# Altium schematic sheet VL53L_SZ_Option.SchDoc: VL53L Single-Zone Options
size A4; DrawnBy: Samyar Sadat Akhavi; Revision: 1.0; SheetNumber: 2; SheetTotal: 3
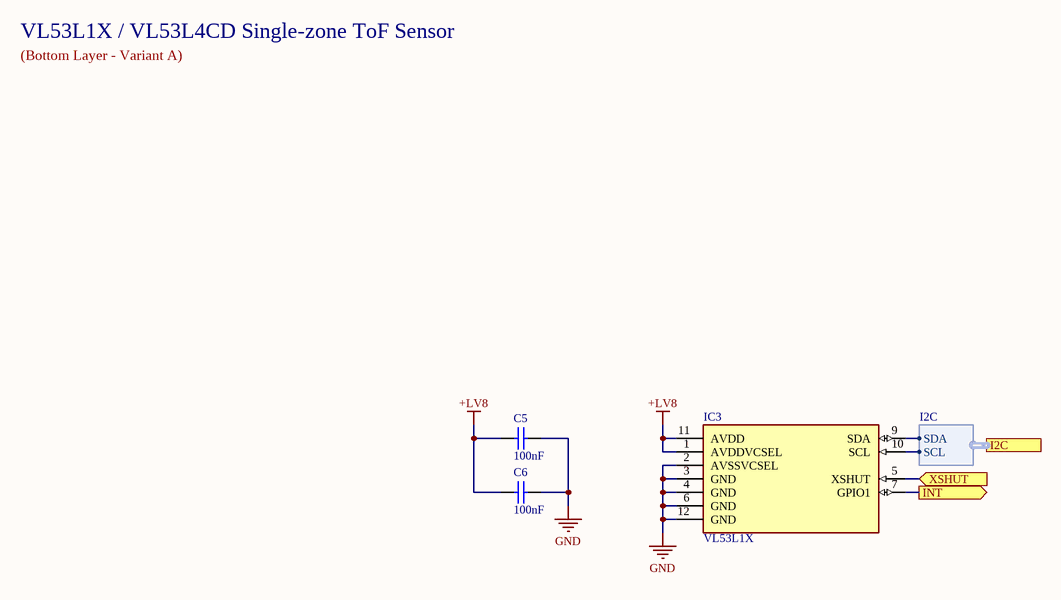
[diagram p0: VL53L_SZ_Option.SchDoc]

## Parts
?  (no value)  (graphical)
C5  100nF  [CAP_SMD_603]
C6  100nF  [CAP_SMD_603]
IC3  VL53L1X  [VL53L1X]

## Ports
I2C (harness I2C, see IR_ToF_Module[2A], VL53L8CX_Option[3B]), INT (out, see IR_ToF_Module[2A], VL53L8CX_Option[3B]), XSHUT (in, see IR_ToF_Module[2A], VL53L8CX_Option[3B])

## Harnesses
I2C: SDA, SCL

## Nets
+LV8: C5.2 C6.1 IC3.1(AVDDVCSEL) IC3.11(AVDD)
GND: C5.1 C6.2 IC3.2(AVSSVCSEL) IC3.3(GND) IC3.4(GND) IC3.6(GND) IC3.12(GND)
INT: IC3.7(GPIO1) ; port INT
XSHUT: IC3.5(XSHUT) ; port XSHUT
NetIC3_9: IC3.9(SDA) ; port I2C.SDA
NetIC3_10: IC3.10(SCL) ; port I2C.SCL

## Notes on the sheet
- VL53L1X / VL53L4CD Single-zone ToF Sensor
- (Bottom Layer - Variant A)
- Sub-Project:
- Size:
- Drawn By:
- Revision:
- Date:
- File:
- Sheet:
- of

## Library data of the parts
? = Standard Title Block
C5 C6 = Non-polar Capacitor: Generic Ceramic Capacitor; Voltage: 6.3V; Value: 100nF
IC3 = VL53L1X: Integrated Circuit; Manufacturer_Name: STMicroelectronics; Datasheet Link: https://www.st.com/resource/en/datasheet/vl53l1x.pdf; Height: 1.6mm; Manufacturer_Part_Number: VL53L1X